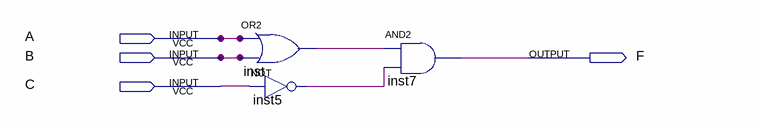
[diagram p0: schematic sheet]
// Quartus schematic lab2step1.bdf as structural Verilog: 3 symbols, 4 pins
module lab2step1 (
  input  A,
  input  B,
  input  C,
  output F
);

  wire inst5_out, inst_out;

  or inst (inst_out, A, B);
  not inst5 (inst5_out, C);
  and inst7 (F, inst_out, inst5_out);
endmodule
